# EAGLE design MAIN_BOARD_02 (EAGLE 9.5.2)

## Sheet 1 of 3
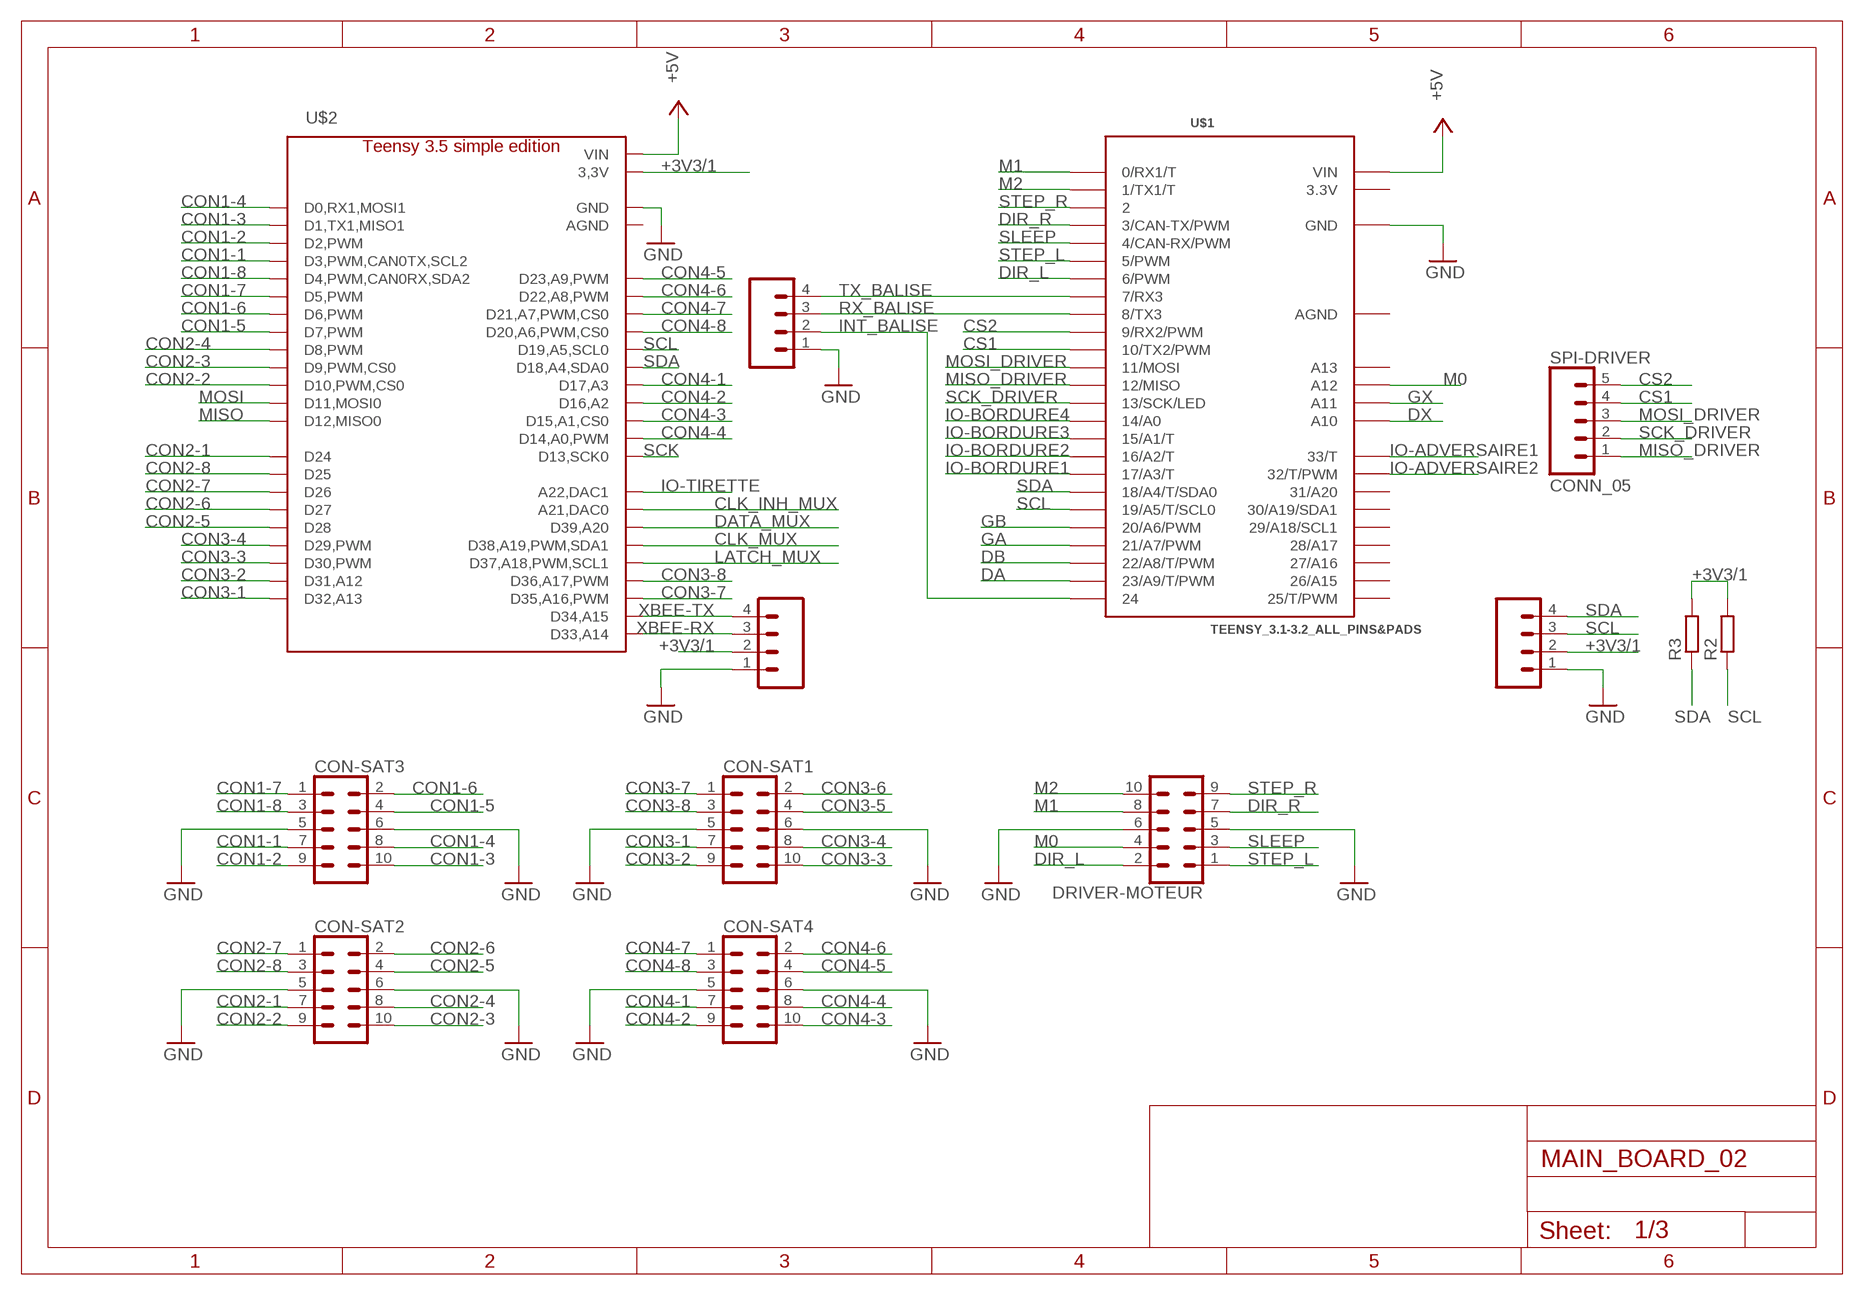
[diagram p0: schematic, sheet 1]

### Parts
COM-BALISE  CONN_04POLAR  [MOLEX-1X4]
COM-I2C  CONN_04POLAR  [MOLEX-1X4]
COM-XBEE  CONN_04POLAR  [MOLEX-1X4]
CON-SAT1  CONN_05X2SHD  [2X5-SHROUDED]
CON-SAT2  CONN_05X2SHD  [2X5-SHROUDED]
CON-SAT3  CONN_05X2SHD  [2X5-SHROUDED]
CON-SAT4  CONN_05X2SHD  [2X5-SHROUDED]
DRIVER-MOTEUR  CONN_05X2SHD  [2X5-SHROUDED]
R2  R-EU_R1206  [R1206]
R3  R-EU_R1206  [R1206]
SPI-DRIVER  CONN_05  [MOLEX-1X5]
U$1  TEENSY_3.1-3.2_ALL_PINS&PADS  [TEENSY_3.0-3.2_ALL_PINS_&_PADS]
U$2  TEENSY_3.5  [TEENSY_3.5_LIGHT]

### Nets
+3V3/1: COM-I2C.2 COM-XBEE.2 R2.2 R3.2 U$2.P$15(3,3V) U$2.P$46(3,3V)
+5V: U$1.VIN U$2.P$48(VIN) ; also sheet 2,3
CLK_INH_MUX: U$2.P$32(A21,DAC0) ; also sheet 2
CLK_MUX: U$2.P$30(D38,A19,PWM,SDA1) ; also sheet 2
CON1-1: CON-SAT3.7 U$2.P$5(D3,PWM,CAN0TX,SCL2)
CON1-2: CON-SAT3.9 U$2.P$4(D2,PWM)
CON1-3: CON-SAT3.10 U$2.P$3(D1,TX1,MISO1)
CON1-4: CON-SAT3.8 U$2.P$2(D0,RX1,MOSI1)
CON1-5: CON-SAT3.4 U$2.P$9(D7,PWM)
CON1-6: CON-SAT3.2 U$2.P$8(D6,PWM)
CON1-7: CON-SAT3.1 U$2.P$7(D5,PWM)
CON1-8: CON-SAT3.3 U$2.P$6(D4,PWM,CAN0RX,SDA2)
CON2-1: CON-SAT2.7 U$2.P$16(D24)
CON2-2: CON-SAT2.9 U$2.P$12(D10,PWM,CS0)
CON2-3: CON-SAT2.10 U$2.P$11(D9,PWM,CS0)
CON2-4: CON-SAT2.8 U$2.P$10(D8,PWM)
CON2-5: CON-SAT2.4 U$2.P$20(D28)
CON2-6: CON-SAT2.2 U$2.P$19(D27)
CON2-7: CON-SAT2.1 U$2.P$18(D26)
CON2-8: CON-SAT2.3 U$2.P$17(D25)
CON3-1: CON-SAT1.7 U$2.P$24(D32,A13)
CON3-2: CON-SAT1.9 U$2.P$23(D31,A12)
CON3-3: CON-SAT1.10 U$2.P$22(D30,PWM)
CON3-4: CON-SAT1.8 U$2.P$21(D29,PWM)
CON3-5: CON-SAT1.4
CON3-6: CON-SAT1.2
CON3-7: CON-SAT1.1 U$2.P$27(D35,A16,PWM)
CON3-8: CON-SAT1.3 U$2.P$28(D36,A17,PWM)
CON4-1: CON-SAT4.7 U$2.P$39(D17,A3)
CON4-2: CON-SAT4.9 U$2.P$38(D16,A2)
CON4-3: CON-SAT4.10 U$2.P$37(D15,A1,CS0)
CON4-4: CON-SAT4.8 U$2.P$36(D14,A0,PWM)
CON4-5: CON-SAT4.4 U$2.P$45(D23,A9,PWM)
CON4-6: CON-SAT4.2 U$2.P$44(D22,A8,PWM)
CON4-7: CON-SAT4.1 U$2.P$43(D21,A7,PWM,CS0)
CON4-8: CON-SAT4.3 U$2.P$42(D20,A6,PWM,CS0)
CS1: SPI-DRIVER.4 U$1.10(10/TX2/PWM)
CS2: SPI-DRIVER.5 U$1.9(9/RX2/PWM)
DA: U$1.23/A9(23/A9/T/PWM) ; also sheet 2
DATA_MUX: U$2.P$31(D39,A20) ; also sheet 2
DB: U$1.22/A8(22/A8/T/PWM) ; also sheet 2
DIR_L: DRIVER-MOTEUR.2 U$1.6(6/PWM)
DIR_R: DRIVER-MOTEUR.7 U$1.3(3/CAN-TX/PWM)
DX: U$1.A10 ; also sheet 2
GA: U$1.21/A7(21/A7/PWM) ; also sheet 2
GB: U$1.20/A6(20/A6/PWM) ; also sheet 2
GND: COM-BALISE.1 COM-I2C.1 COM-XBEE.1 CON-SAT1.5 CON-SAT1.6 CON-SAT2.5 CON-SAT2.6 CON-SAT3.5 CON-SAT3.6 CON-SAT4.5 CON-SAT4.6 DRIVER-MOTEUR.5 DRIVER-MOTEUR.6 U$1.GND U$1.GND2(GND) U$2.GND U$2.P$34(GND) ; also sheet 2,3
GX: U$1.A11 ; also sheet 2
INT_BALISE: COM-BALISE.2 U$1.24
IO-ADVERSAIRE1: U$1.33(33/T) ; also sheet 2
IO-ADVERSAIRE2: U$1.32(32/T/PWM) ; also sheet 2
IO-BORDURE1: U$1.17/A3(17/A3/T) ; also sheet 2
IO-BORDURE2: U$1.16/A2(16/A2/T) ; also sheet 2
IO-BORDURE3: U$1.15/A1(15/A1/T) ; also sheet 2
IO-BORDURE4: U$1.14/A0 ; also sheet 2
IO-TIRETTE: U$2.P$33(A22,DAC1) ; also sheet 2
LATCH_MUX: U$2.P$29(D37,A18,PWM,SCL1) ; also sheet 2
M0: DRIVER-MOTEUR.4 U$1.A12
M1: DRIVER-MOTEUR.8 U$1.0(0/RX1/T)
M2: DRIVER-MOTEUR.10 U$1.1(1/TX1/T)
MISO: U$2.P$14(D12,MISO0) ; also sheet 2
MISO_DRIVER: SPI-DRIVER.1 U$1.12(12/MISO)
MOSI: U$2.P$13(D11,MOSI0) ; also sheet 2
MOSI_DRIVER: SPI-DRIVER.3 U$1.11(11/MOSI)
RX_BALISE: COM-BALISE.3 U$1.8(8/TX3)
SCK: U$2.P$35(D13,SCK0) ; also sheet 2
SCK_DRIVER: SPI-DRIVER.2 U$1.13(13/SCK/LED)
SCL: COM-I2C.3 R2.1 U$1.19/A5(19/A5/T/SCL0) U$2.P$41(D19,A5,SCL0)
SDA: COM-I2C.4 R3.1 U$1.18/A4(18/A4/T/SDA0) U$2.P$40(D18,A4,SDA0)
SLEEP: DRIVER-MOTEUR.3 U$1.4(4/CAN-RX/PWM)
STEP_L: DRIVER-MOTEUR.1 U$1.5(5/PWM)
STEP_R: DRIVER-MOTEUR.9 U$1.2
TX_BALISE: COM-BALISE.4 U$1.7(7/RX3)
XBEE-RX: COM-XBEE.3 U$2.P$25(D33,A14)
XBEE-TX: COM-XBEE.4 U$2.P$26(D34,A15)
Unconnected: U$1.25(25/T/PWM) U$1.26(26/A15) U$1.27(27/A16) U$1.28(28/A17) U$1.29(29/A18/SCL1) U$1.30(30/A19/SDA1) U$1.31(31/A20) U$1.A13 U$2.P$47(AGND)

## Sheet 2 of 3
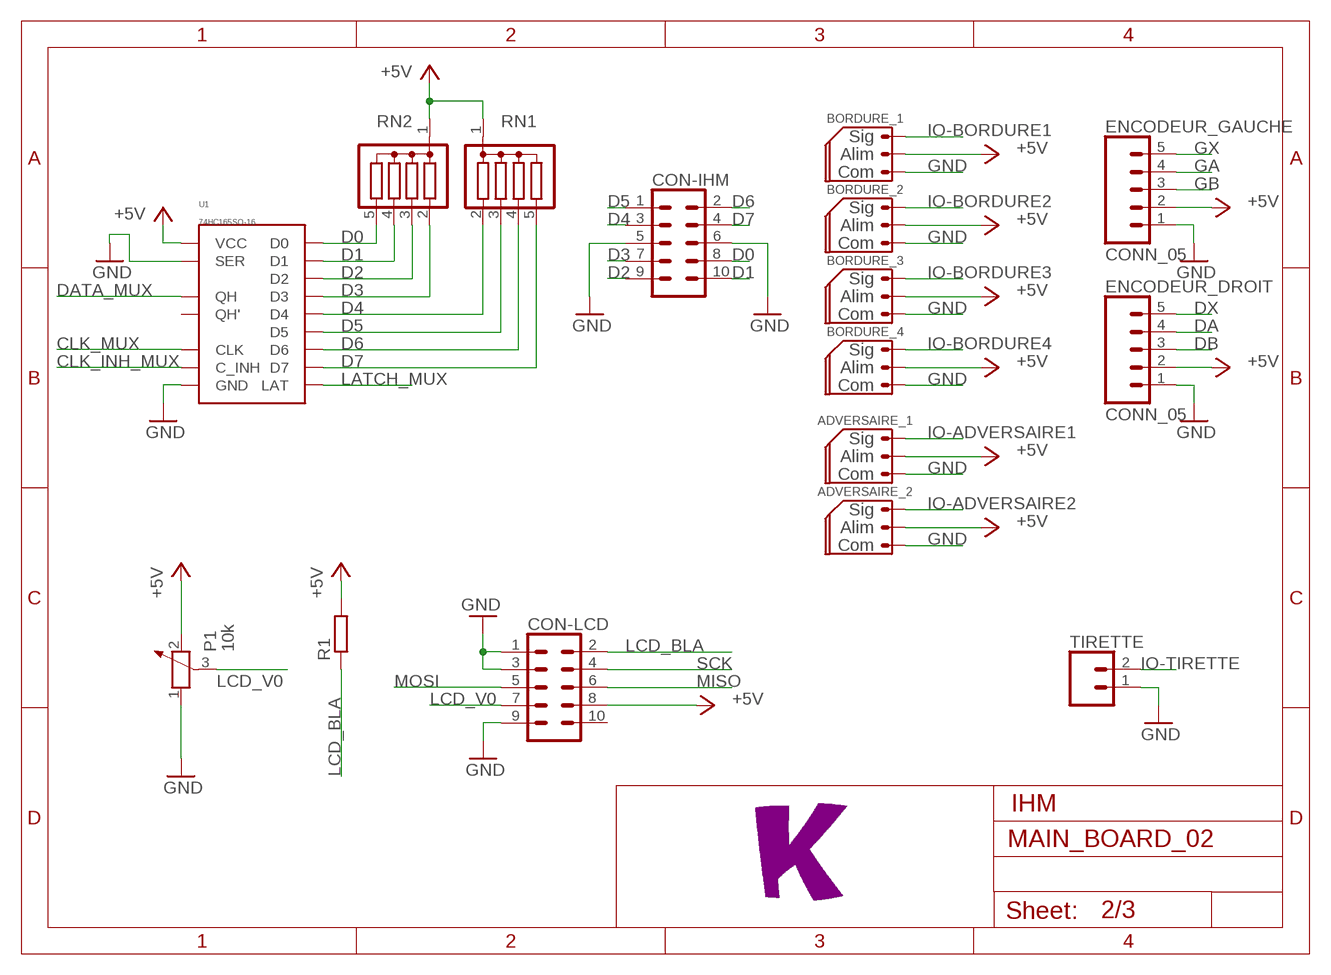
[diagram p1: schematic, sheet 2]

### Parts
ADVERSAIRE_1  CONN_03_SERVO  [MOLEX-1X3]
ADVERSAIRE_2  CONN_03_SERVO  [MOLEX-1X3]
BORDURE_1  CONN_03_SERVO  [MOLEX-1X3]
BORDURE_2  CONN_03_SERVO  [MOLEX-1X3]
BORDURE_3  CONN_03_SERVO  [MOLEX-1X3]
BORDURE_4  CONN_03_SERVO  [MOLEX-1X3]
CON-IHM  CONN_05X2SHD  [2X5-SHROUDED]
CON-LCD  CONN_05X2SHD  [2X5-SHROUDED]
ENCODEUR_DROIT  CONN_05  [MOLEX-1X5]
ENCODEUR_GAUCHE  CONN_05  [MOLEX-1X5]
P1  10k  POTENTIOMETER_PT-10  [PT-10]
R1  R-EU_R1206  [R1206]
RN1  G04R  [SIL5]
RN2  G04R  [SIL5]
TIRETTE  CONN_02POLAR  [MOLEX-1X2]
U1  74HC165SO-16  [SO-16]
U$3  LOGO_K  [LOGO_KARIBOU]

### Nets
+5V: ADVERSAIRE_1.2 ADVERSAIRE_2.2 BORDURE_1.2 BORDURE_2.2 BORDURE_3.2 BORDURE_4.2 CON-LCD.8 ENCODEUR_DROIT.2 ENCODEUR_GAUCHE.2 P1.2 R1.2 RN1.1 RN2.1 U1.16(VCC) ; also sheet 1,3
CLK_INH_MUX: U1.15(C_INH) ; also sheet 1
CLK_MUX: U1.2(CLK) ; also sheet 1
D0: CON-IHM.8 RN2.5 U1.11(D0)
D1: CON-IHM.10 RN2.4 U1.12(D1)
D2: CON-IHM.9 RN2.3 U1.13(D2)
D3: CON-IHM.7 RN2.2 U1.14(D3)
D4: CON-IHM.3 RN1.2 U1.3(D4)
D5: CON-IHM.1 RN1.3 U1.4(D5)
D6: CON-IHM.2 RN1.4 U1.5(D6)
D7: CON-IHM.4 RN1.5 U1.6(D7)
DA: ENCODEUR_DROIT.4 ; also sheet 1
DATA_MUX: U1.9(QH) ; also sheet 1
DB: ENCODEUR_DROIT.3 ; also sheet 1
DX: ENCODEUR_DROIT.5 ; also sheet 1
GA: ENCODEUR_GAUCHE.4 ; also sheet 1
GB: ENCODEUR_GAUCHE.3 ; also sheet 1
GND: ADVERSAIRE_1.1 ADVERSAIRE_2.1 BORDURE_1.1 BORDURE_2.1 BORDURE_3.1 BORDURE_4.1 CON-IHM.5 CON-IHM.6 CON-LCD.1 CON-LCD.3 CON-LCD.9 ENCODEUR_DROIT.1 ENCODEUR_GAUCHE.1 P1.1 TIRETTE.1 U1.8(GND) U1.10(SER) ; also sheet 1,3
GX: ENCODEUR_GAUCHE.5 ; also sheet 1
IO-ADVERSAIRE1: ADVERSAIRE_1.3 ; also sheet 1
IO-ADVERSAIRE2: ADVERSAIRE_2.3 ; also sheet 1
IO-BORDURE1: BORDURE_1.3 ; also sheet 1
IO-BORDURE2: BORDURE_2.3 ; also sheet 1
IO-BORDURE3: BORDURE_3.3 ; also sheet 1
IO-BORDURE4: BORDURE_4.3 ; also sheet 1
IO-TIRETTE: TIRETTE.2 ; also sheet 1
LATCH_MUX: U1.1(LAT) ; also sheet 1
LCD_BLA: CON-LCD.2 R1.1
LCD_V0: CON-LCD.7 P1.3
MISO: CON-LCD.6 ; also sheet 1
MOSI: CON-LCD.5 ; also sheet 1
SCK: CON-LCD.4 ; also sheet 1
Unconnected: CON-LCD.10 U1.7(QH')

### Notes on the sheet
- IHM

## Sheet 3 of 3
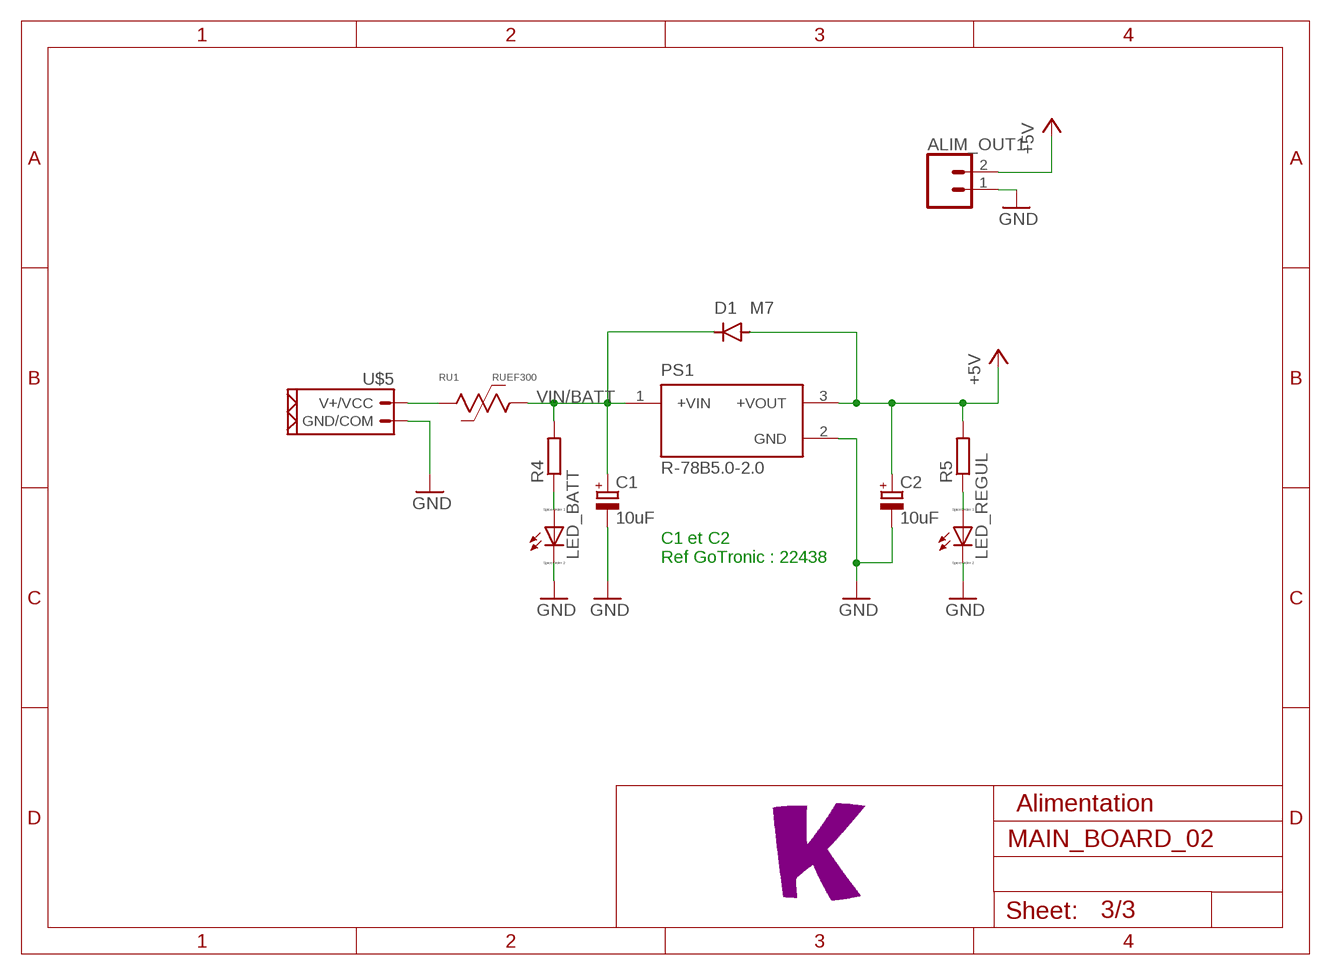
[diagram p2: schematic, sheet 3]

### Parts
ALIM_OUT1  CONN_02POLAR  [MOLEX-1X2]
C1  10uF  CPOL-EU153CLV-0505  [153CLV-0505]
C2  10uF  CPOL-EU153CLV-0505  [153CLV-0505]
D1  M7  CDBM1100-G  [MINI-SMA]
LED_BATT  LED_E  [LED_1206]
LED_REGUL  LED_E  [LED_1206]
PS1  R-78B5.0-2.0  [CONV_R-78B5.0-2.0]
R4  R-EU_R1206  [R1206]
R5  R-EU_R1206  [R1206]
RU1  RUEF300  [RUEF300]
U$4  LOGO_K  [LOGO_KARIBOU]
U$5  CONN_02_PUIXT30  [XT30_FEMALE]

### Nets
+5V: ALIM_OUT1.2 C2.+ D1.ANODE PS1.3(+VOUT) R5.2 ; also sheet 1,2
GND: ALIM_OUT1.1 C1.- C2.- LED_BATT.C LED_REGUL.C PS1.2(GND) U$5.P$2(GND/COM) ; also sheet 1,2
N$1: LED_REGUL.A R5.1
N$3: LED_BATT.A R4.1
N$4: RU1.P$1 U$5.P$1(V+/VCC)
VIN/BATT: C1.+ D1.KATHODE PS1.1(+VIN) R4.2 RU1.P$2

### Notes on the sheet
- C1 et C2
  Ref GoTronic : 22438
- Alimentation

## Power pins joined to a net without a drawn wire
3.3V: U$1.3.3V U$1.3.3V2(3.3V)
AGND: U$1.AGND

## Library data of the parts
ADVERSAIRE_1 ADVERSAIRE_2 BORDURE_1-BORDURE_4 = OPENBOT:CONN_03_SERVO
ALIM_OUT1 TIRETTE = OPENBOT:CONN_02: Multi connection point. Often used as Generic Header-pin footprint for 0.1 inch spaced/style header connections On any of the 0.1 inch spaced packages, you can populate with these: Break Away Headers - Straight <https://www.sparkfun.com/products/116> (PRT-00116) Break Away Male Headers - Right Angle <https://www.sparkfun.com/products/553> (PRT-00553) Female Headers <https://www.sparkfun.com/products/115> (PRT-00115) Break Away Headers - Machine Pin <https://www.sparkfun.com/products/117> (PRT-00117) Break Away Female Headers - Swiss Machine Pin <https://www.sparkfun.com/products/743> (PRT-00743) For SCREWTERMINALS and SPRING TERMINALS visit here: Screw Terimnals on SparkFun.com <https://www.sparkfun.com/search/results?term=Screw+Terminals> (5mm/3.5mm/2.54mm spacing) This device is also useful as a general connection point to wire up your design to another part of your project. Our various solder wires solder well into these plated through hole pads. Hook-Up Wire - Assortment (Stranded, 22 AWG) <https://www.sparkfun.com/products/11375> (PRT-11375) Hook-Up Wire - Assortment (Solid Core, 22 AWG) <https://www.sparkfun.com/products/11367> (PRT-11367) View the entire wire category on our website here <https://www.sparkfun.com/categories/141> Special notes: Molex polarized connector foot print use with: PRT-08233 with associated crimp pins and housings. 2.54_SCREWTERM for use with PRT-10571. 3.5mm Screw Terminal footprints for PRT-08084 5mm Screw Terminal footprints for use with PRT-08432 Multi connection point. Often used as Generic Header-pin footprint for 0.1 inch spaced/style header connections On any of the 0.1 inch spaced packages, you can populate with these: Break Away Headers - Straight <https://www.sparkfun.com/products/116> (PRT-00116) Break Away Male Headers - Right Angle <https://www.sparkfun.com/products/553> (PRT-00553) Female Headers <https://www.sparkfun.com/products/115> (PRT-00115) Break Away Headers - Machine Pin <https://www.sparkfun.com/products/117> (PRT-00117) Break Away Female Headers - Swiss Machine Pin <https://www.sparkfun.com/products/743> (PRT-00743) For SCREWTERMINALS and SPRING TERMINALS visit here: Screw Terimnals on SparkFun.com <https://www.sparkfun.com/search/results?term=Screw+Terminals> (5mm/3.5mm/2.54mm spacing) This device is also useful as a general connection point to wire up your design to another part of your project. Our various solder wires solder well into these plated through hole pads. Hook-Up Wire - Assortment (Stranded, 22 AWG) <https://www.sparkfun.com/products/11375> (PRT-11375) Hook-Up Wire - Assortment (Solid Core, 22 AWG) <https://www.sparkfun.com/products/11367> (PRT-11367) View the entire wire category on our website here <https://www.sparkfun.com/categories/141> Special notes: Molex polarized connector foot print use with: PRT-08233 with associated crimp pins and housings. 2.54_SCREWTERM for use with PRT-10571. 3.5mm Screw Terminal footprints for PRT-08084 5mm Screw Terminal footprints for use with PRT-08432; SF_ID: PRT-09918
C1 C2 = rcl:CPOL-EU: POLARIZED CAPACITOR, European symbol; SPICEPREFIX: C
COM-BALISE COM-I2C COM-XBEE = OPENBOT:CONN_04: Multi connection point. Often used as Generic Header-pin footprint for 0.1 inch spaced/style header connections On any of the 0.1 inch spaced packages, you can populate with these: Break Away Headers - Straight <https://www.sparkfun.com/products/116> (PRT-00116) Break Away Male Headers - Right Angle <https://www.sparkfun.com/products/553> (PRT-00553) Female Headers <https://www.sparkfun.com/products/115> (PRT-00115) Break Away Headers - Machine Pin <https://www.sparkfun.com/products/117> (PRT-00117) Break Away Female Headers - Swiss Machine Pin <https://www.sparkfun.com/products/743> (PRT-00743) For SCREWTERMINALS and SPRING TERMINALS visit here: Screw Terimnals on SparkFun.com <https://www.sparkfun.com/search/results?term=Screw+Terminals> (5mm/3.5mm/2.54mm spacing) This device is also useful as a general connection point to wire up your design to another part of your project. Our various solder wires solder well into these plated through hole pads. Hook-Up Wire - Assortment (Stranded, 22 AWG) <https://www.sparkfun.com/products/11375> (PRT-11375) Hook-Up Wire - Assortment (Solid Core, 22 AWG) <https://www.sparkfun.com/products/11367> (PRT-11367) View the entire wire category on our website here <https://www.sparkfun.com/categories/141> Special notes: Molex polarized connector foot print use with SKU : PRT-08231 with associated crimp pins and housings. 1MM SMD Version SKU: PRT-10208 Multi connection point. Often used as Generic Header-pin footprint for 0.1 inch spaced/style header connections On any of the 0.1 inch spaced packages, you can populate with these: Break Away Headers - Straight <https://www.sparkfun.com/products/116> (PRT-00116) Break Away Male Headers - Right Angle <https://www.sparkfun.com/products/553> (PRT-00553) Female Headers <https://www.sparkfun.com/products/115> (PRT-00115) Break Away Headers - Machine Pin <https://www.sparkfun.com/products/117> (PRT-00117) Break Away Female Headers - Swiss Machine Pin <https://www.sparkfun.com/products/743> (PRT-00743) For SCREWTERMINALS and SPRING TERMINALS visit here: Screw Terimnals on SparkFun.com <https://www.sparkfun.com/search/results?term=Screw+Terminals> (5mm/3.5mm/2.54mm spacing) This device is also useful as a general connection point to wire up your design to another part of your project. Our various solder wires solder well into these plated through hole pads. Hook-Up Wire - Assortment (Stranded, 22 AWG) <https://www.sparkfun.com/products/11375> (PRT-11375) Hook-Up Wire - Assortment (Solid Core, 22 AWG) <https://www.sparkfun.com/products/11367> (PRT-11367) View the entire wire category on our website here <https://www.sparkfun.com/categories/141> Special notes: Molex polarized connector foot print use with SKU : PRT-08231 with associated crimp pins and housings. 1MM SMD Version SKU: PRT-10208; PROD_ID: CONN-08186; SF_ID: PRT-08231
CON-IHM CON-LCD CON-SAT1-CON-SAT4 DRIVER-MOTEUR = OPENBOT:CONN_05X2: Multi connection point. Often used as Generic Header-pin footprint for 0.1 inch spaced/style header connections For AVR SPI programming port, see special device with nice symbol: "AVR_SPI_PROG_5x2.dev" You can populate with any combo of single row headers, but if you'd like an exact match, check these: 2x5 AVR ICSP Male Header <https://www.sparkfun.com/products/778> (PRT-00778) 2x5 Pin Shrouded Header <https://www.sparkfun.com/products/8506> (PRT-08506) On any of the 0.1 inch spaced packages, you can populate with these: Break Away Headers - Straight <https://www.sparkfun.com/products/116> (PRT-00116) Break Away Male Headers - Right Angle <https://www.sparkfun.com/products/553> (PRT-00553) Female Headers <https://www.sparkfun.com/products/115> (PRT-00115) Break Away Headers - Machine Pin <https://www.sparkfun.com/products/117> (PRT-00117) Break Away Female Headers - Swiss Machine Pin <https://www.sparkfun.com/products/743> (PRT-00743) Special note: the shrouded connector mates well with our 5x2 ribbon cables: 2x5 Pin IDC Ribbon Cable <https://www.sparkfun.com/products/8535> (PRT-08535); PROD_ID: CONN-08671; SF_ID: PRT-08506
D1 = fab:CDBM1100-G: Diode schottky 100V 1A mini-SMA as found in the fablab inventory Reverse Voltage: 100 Volts Forward Current: 1.0 Amp Maximum forward voltage: 0.85 Volts Made by Zaerc.
ENCODEUR_DROIT ENCODEUR_GAUCHE SPI-DRIVER = OPENBOT:CONN_05
LED_BATT LED_REGUL = eagle-ltspice:LED_E: LED Source: http://www.osram.convergy.de Source: www.luxeon.com Source: www.kingbright.com; SPICEMODEL: NONE; SPICEPREFIX: D; SPICETYPE: diode
P1 = rcl:POTENTIOMETER_: Potentiometer
PS1 = OPENBOT:R-78B5.0-2.0: 2.0 Amp SIP3 Single Output; AVAILABILITY: Unavailable; DESCRIPTION: 2A DC/DC-Converter 'INNOLINE' SIP3 reg; MF: Recom Power; MP: R-78B5.0-2.0; PACKAGE: SIP-3 Recom Power; PRICE: None
R1-R5 = rcl:R-EU_: RESISTOR, European symbol; SPICEPREFIX: R
RN1 RN2 = resistor-sil:G04R: SIL RESISTOR; OC_FARNELL: unknown; OC_NEWARK: unknown
RU1 = OPENBOT:RUEF300
U1 = OPENBOT:74HC165; AVAILABILITY: Unavailable; DESCRIPTION: Shift Shift Register 1 Element 8 Bit 16-SO; MF: Nexperia USA; MP: 74HC165; PACKAGE: VFQFN-16 STMicroelectronics; PRICE: None
U$1 = OPENBOT:TEENSY_3.1-3.2_ALL_PINS&PADS: Footprint for Teensy 3.1 or 3.2 board using all pads and all through-holes. Pads need a 2x7 0.1" SMD header.
U$2 = KARIBOUS:TEENSY_3.5
U$3 U$4 = KARIBOUS:LOGO_K
U$5 = OPENBOT:CONN_02_PUI

## Board
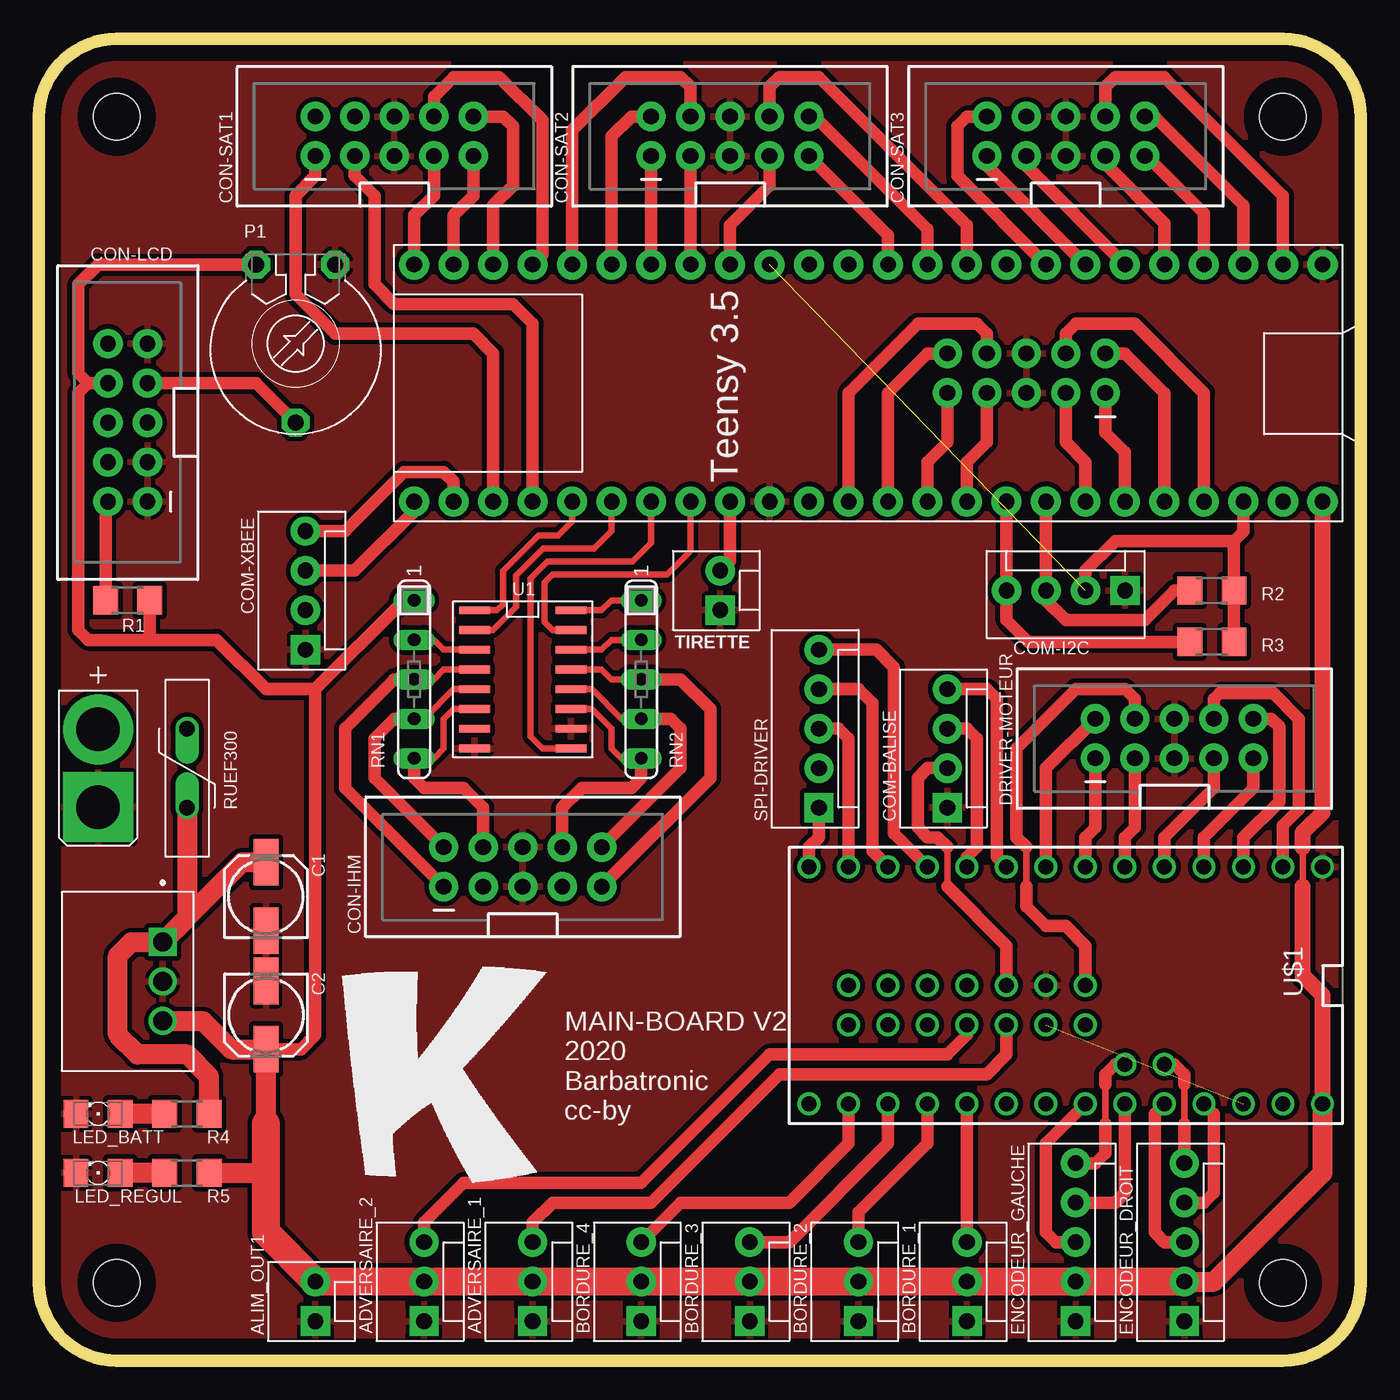
[diagram p3: board, top side]
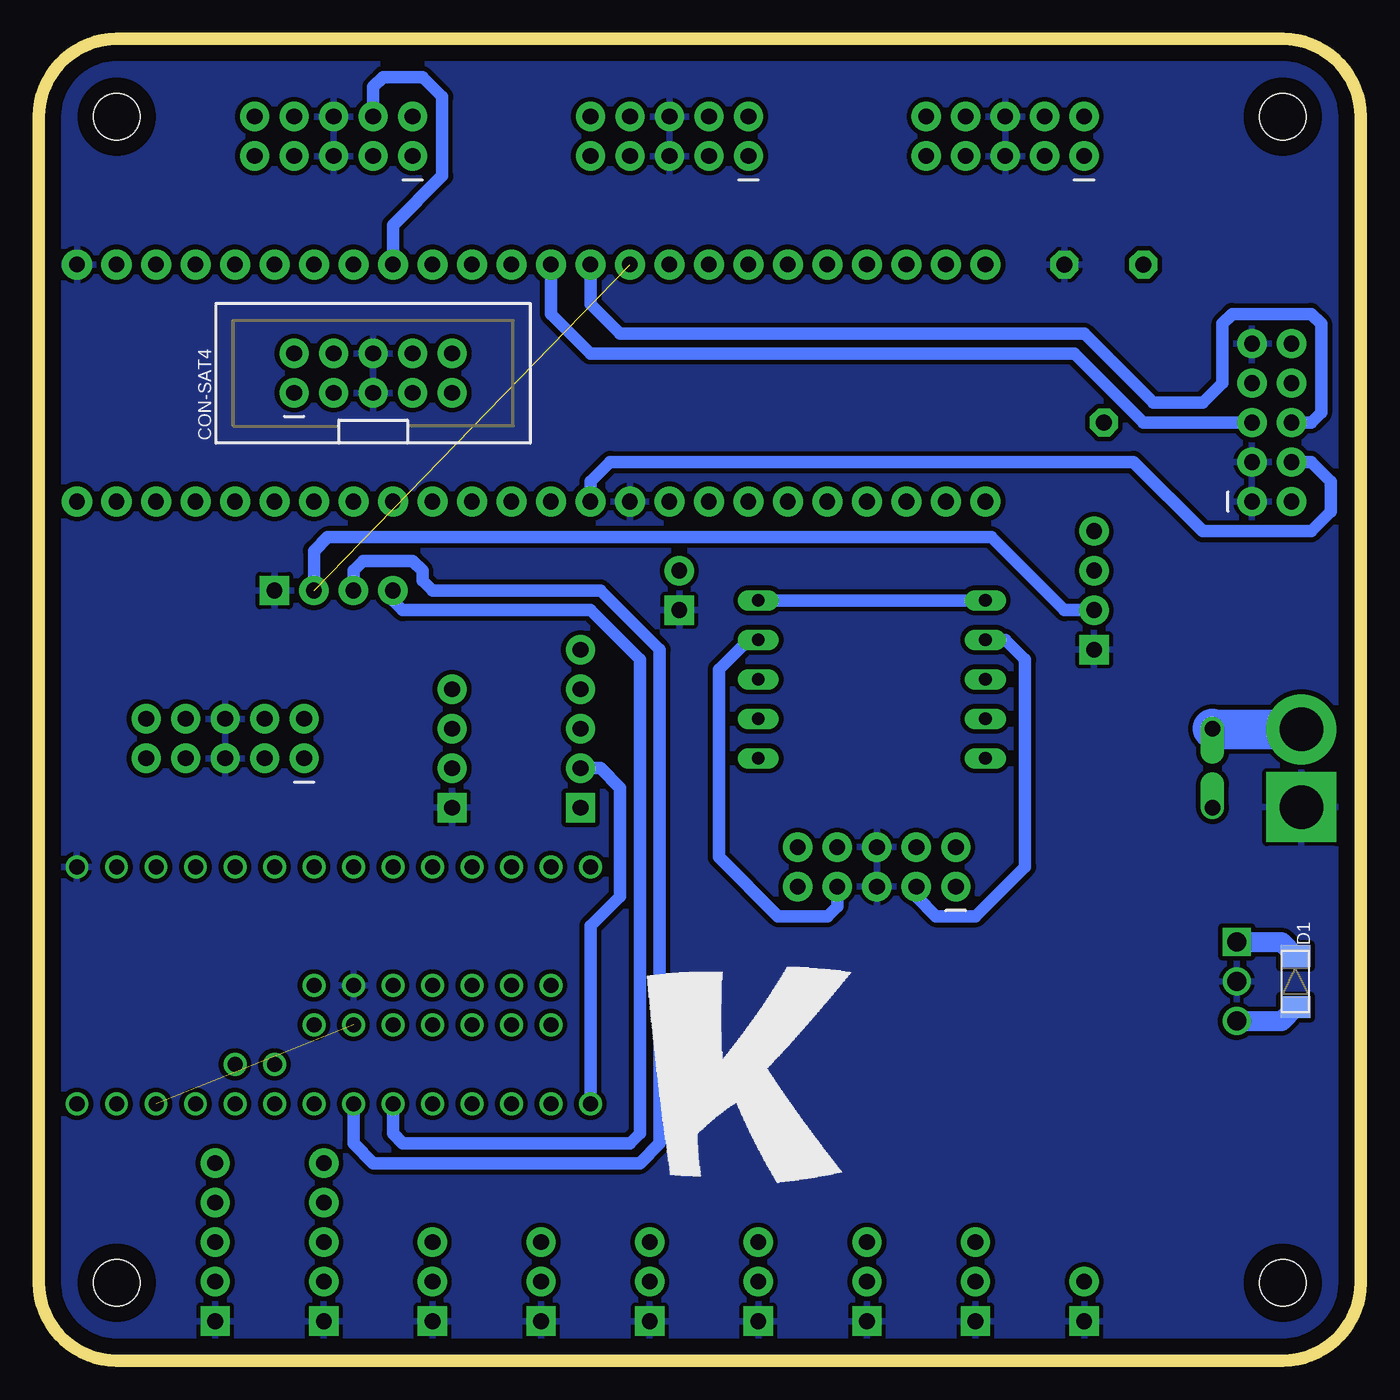
[diagram p4: board, bottom side, seen from below]

Size 85 x 85 mm. Coordinates in mm from the lower left corner, seen from the top.
Outline: 5,0 80,0 arc90 85,5 85,80 arc90 80,85 5,85 arc90 0,80 0,5 arc90 5,0
Copper layers (1*16): Top 0.035mm / dielectric 1.5mm / Bottom 0.035mm
Design rules "default *": minimum track width 6mil, minimum drill 0.35mm, track to track 12mil, track to pad 12mil, pad to pad 6mil, via to via 6mil, smd to smd 6mil, copper to edge 40mil, drill to drill 6mil, minimum pad ring 10mil, minimum via ring 8mil, stop-mask expansion 4mil, vias tented up to drill 0mil, thermal gap 10mil
Holes 3 mm at 5,5 5,80 80,5 80,80

### Footprints (pad centres in the part's own frame; a part is rotated, then mirrored left to right if it is on the bottom)
MOLEX-1X3 = drill 1.016 pad 1.88 square: 1 0,0 | drill 1.016 pad 1.88: 2 2.54,0; 3 5.08,0
MOLEX-1X2 = drill 1.016 pad 1.88 square: 1 0,0 | drill 1.016 pad 1.88: 2 2.54,0
153CLV-0505 = smd 3 x 1.6: + 2.2,0; - -2.2,0
MOLEX-1X4 = drill 1.016 pad 1.88 square: 1 0,0 | drill 1.016 pad 1.88: 2 2.54,0; 3 5.08,0; 4 7.62,0
2X5-SHROUDED = drill 1.016 pad 1.88: 1 -1.27,5.08; 2 1.27,5.08; 3 -1.27,2.54; 4 1.27,2.54; 5 -1.27,0; 6 1.27,0; 7 -1.27,-2.54; 8 1.27,-2.54; 9 -1.27,-5.08; 10 1.27,-5.08
MINI-SMA = smd 1.4 x 1.9: ANODE 1.65,0; KATHODE -1.65,0
MOLEX-1X5 = drill 1.016 pad 1.88 square: 1 0,0 | drill 1.016 pad 1.88: 2 2.54,0; 3 5.08,0; 4 7.62,0; 5 10.16,0
LED_1206 = smd 1.6 x 1.803: A -1.422,0; C 1.422,0
PT-10 = drill 1.016 pad 1.778 octagon: 1 -2.54,-5.08; 2 2.54,-5.08; 3 0,5.08
CONV_R-78B5.0-2.0 = drill 1.2 square: 1 -2.54,2.25 | drill 1.2: 2 0,2.25; 3 2.54,2.25
R1206 = smd 1.6 x 1.803: 1 -1.422,0; 2 1.422,0
SIL5 = drill 0.813 long: 1 -5.08,0; 2 -2.54,0; 3 0,0; 4 2.54,0; 5 5.08,0
RUEF300 = drill 1 offset: P$1 -2.54,0; P$2 2.54,0
SO-16 = smd 0.5 x 2: 1 -4.445,-3.1; 2 -3.175,-3.1; 3 -1.905,-3.1; 4 -0.635,-3.1; 5 0.635,-3.1; 6 1.905,-3.1; 7 3.175,-3.1; 8 4.445,-3.1; 9 4.445,3.1; 10 3.175,3.1; 11 1.905,3.1; 12 0.635,3.1; 13 -0.635,3.1; 14 -1.905,3.1; 15 -3.175,3.1; 16 -4.445,3.1
TEENSY_3.0-3.2_ALL_PINS_&_PADS = drill 0.965: 0 -7.62,13.97; 1 -7.62,11.43; 2 -7.62,8.89; 3 -7.62,6.35; 3.3V 7.62,11.43; 3.3V2 2.54,-1.27; 4 -7.62,3.81; 5 -7.62,1.27; 6 -7.62,-1.27; 7 -7.62,-3.81; 8 -7.62,-6.35; 9 -7.62,-8.89; 10 -7.62,-11.43; 11 -7.62,-13.97; 12 -7.62,-16.51; 13 7.62,-16.51; 14/A0 7.62,-13.97; 15/A1 7.62,-11.43; 16/A2 7.62,-8.89; 17/A3 7.62,-6.35; 18/A4 7.62,-3.81; 19/A5 7.62,-1.27; 20/A6 7.62,1.27; 21/A7 7.62,3.81; 22/A8 7.62,6.35; 23/A9 7.62,8.89; 24 0,-3.81; 25 0,-6.35; 26 0,-8.89; 27 0,-11.43; 28 0,-13.97; 29 2.54,-13.97; 30 2.54,-11.43; 31 2.54,-8.89; 32 2.54,-6.35; 33 2.54,-3.81; A10 5.08,6.35; A11 5.08,3.81; A12 0,1.27; A13 2.54,1.27; AGND 7.62,13.97; GND -7.62,16.51; GND2 0,-1.27; VIN 7.62,16.51
TEENSY_3.5_LIGHT = drill 1 pad 1.93: GND -7.62,0; P$2 -7.62,-2.54; P$3 -7.62,-5.08; P$4 -7.62,-7.62; P$5 -7.62,-10.16; P$6 -7.62,-12.7; P$7 -7.62,-15.24; P$8 -7.62,-17.78; P$9 -7.62,-20.32; P$10 -7.62,-22.86; P$11 -7.62,-25.4; P$12 -7.62,-27.94; P$13 -7.62,-30.48; P$14 -7.62,-33.02; P$15 -7.62,-35.56; P$16 -7.62,-38.1; P$17 -7.62,-40.64; P$18 -7.62,-43.18; P$19 -7.62,-45.72; P$20 -7.62,-48.26; P$21 -7.62,-50.8; P$22 -7.62,-53.34; P$23 -7.62,-55.88; P$24 -7.62,-58.42; P$25 7.62,-58.42; P$26 7.62,-55.88; P$27 7.62,-53.34; P$28 7.62,-50.8; P$29 7.62,-48.26; P$30 7.62,-45.72; P$31 7.62,-43.18; P$32 7.62,-40.64; P$33 7.62,-38.1; P$34 7.62,-35.56; P$35 7.62,-33.02; P$36 7.62,-30.48; P$37 7.62,-27.94; P$38 7.62,-25.4; P$39 7.62,-22.86; P$40 7.62,-20.32; P$41 7.62,-17.78; P$42 7.62,-15.24; P$43 7.62,-12.7; P$44 7.62,-10.16; P$45 7.62,-7.62; P$46 7.62,-5.08; P$47 7.62,-2.54; P$48 7.62,0
XT30_FEMALE = drill 2.8 pad 4.5: P$1 -2.5,0 | drill 2.8 pad 4.5 square: P$2 2.5,0

### Placement (x,y rotation side)
ADVERSAIRE_1  31.75,2.54 90 top
ADVERSAIRE_2  24.77,2.54 90 top
ALIM_OUT1  17.78,2.54 90 top
BORDURE_1  59.69,2.54 90 top
BORDURE_2  52.7,2.54 90 top
BORDURE_3  45.72,2.54 90 top
BORDURE_4  38.73,2.54 90 top
C1  14.61,29.84 90 top
C2  14.61,22.23 270 top
COM-BALISE  58.42,35.56 90 top
COM-I2C  69.85,49.53 180 top
COM-XBEE  17.14,45.72 90 top
CON-IHM  31.11,31.75 90 top
CON-LCD  5.71,60.33 180 top
CON-SAT1  22.86,78.74 90 top
CON-SAT2  44.45,78.74 90 top
CON-SAT3  66.04,78.74 90 top
CON-SAT4  63.5,63.5 90 bottom
D1  4.19,24.38 270 bottom
DRIVER-MOTEUR  73.03,40.01 90 top
ENCODEUR_DROIT  73.66,2.54 90 top
ENCODEUR_GAUCHE  66.67,2.54 90 top
LED_BATT  3.81,15.88 180 top
LED_REGUL  3.81,12.06 180 top
P1  16.51,65.41 180 top
PS1  5.71,24.38 270 top
R1  5.71,48.9 0 top
R2  75.44,49.53 0 top
R3  75.44,46.23 0 top
R4  9.53,15.88 0 top
R5  9.53,12.06 0 top
RN1  24.13,43.81 270 top
RN2  38.73,43.81 270 top
RU1  9.53,38.1 270 top
SPI-DRIVER  50.16,35.56 90 top
TIRETTE  43.81,48.26 90 top
U1  31.11,43.81 270 top
U$1  66.04,24.13 270 top
U$2  82.55,62.87 270 top
U$3  19.68,11.43 0 top
U$4  45.72,11.43 0 bottom
U$5  3.81,38.1 270 top

### Tracks (layer width: path | path; a pad name or v marks a point on that pad's centre or on a via)
3.3V  (1 unrouted)
+3V3/1  (1 unrouted)
  Top 0.813: COM-I2C.2 67.31,50.8 69.22,52.7 76.86,52.7 | R3.2 R2.2 76.86,52.7 | 76.86,52.7 77.47,53.31 U$2.P$46
  Bottom 0.813: COM-XBEE.2 19.05,48.26 23.75,52.96 66.42,52.96 67.31,52.07 COM-I2C.2
+5V
  Top 0.406: U1.16 36.2,48.26 36.83,48.9 RN2.1 | 81.28,30.48 81.28,33.02
  Top 0.813: 3.17,62.87 2.54,63.5 2.54,69.22 3.81,70.48 P1.2 | CON-LCD.8 3.17,62.87 | 3.17,62.87 2.54,62.23 2.54,46.99 3.17,46.35 6.99,46.35 | 6.99,46.35 7.14,46.51 R1.2 | 17.78,43.18 23.5,48.9 RN1.1 | 6.99,46.35 11.43,46.35 14.61,43.18 17.78,43.18 | C2.+ 16.85,20.02 17.78,20.95 17.78,43.18
  Top 1.016: 81.28,30.48 81.28,24.77 82.55,23.5 U$1.VIN | 81.28,33.02 81.28,33.96 82.55,35.23 U$2.P$48
  Top 1.27: R5.2 14.61,12.06 | PS1.3 10.54,21.84 12.36,20.02 C2.+ 14.61,15.24 | ENCODEUR_DROIT.2 75.56,5.08 82.55,12.06 U$1.VIN
  Top 1.8: ENCODEUR_DROIT.2 ENCODEUR_GAUCHE.2 BORDURE_1.2 BORDURE_2.2 BORDURE_3.2 BORDURE_4.2 ADVERSAIRE_1.2 ADVERSAIRE_2.2 ALIM_OUT1.2 14.61,8.26 14.61,12.06 14.61,15.24
  Bottom 0.813: RN1.1 RN2.1
  Bottom 1.27: PS1.3 5.08,21.84 D1.ANODE
CLK_INH_MUX
  Top 0.406: U1.15 33.02,46.99 32.51,47.5 32.51,50.04 33.02,50.55 40.39,50.55 41.91,52.07 U$2.P$32
CLK_MUX
  Top 0.406: U$2.P$30 36.83,53.34 35.71,52.22 32.43,52.22 30.68,50.48 30.68,48.46 29.21,46.99 U1.2
CON1-1
  Top 0.813: CON-SAT3.7 68.58,76.96 72.39,73.15 U$2.P$5
CON1-2
  Top 0.813: CON-SAT3.9 71.25,77.47 74.93,73.79 U$2.P$4
CON1-3
  Top 0.813: CON-SAT3.10 71.75,80.01 77.47,74.3 U$2.P$3
CON1-4
  Top 0.813: U$2.P$2 80.01,74.93 72.39,82.55 69.22,82.55 68.58,81.92 CON-SAT3.8
CON1-5
  Bottom 0.813: U$2.P$9 62.23,73.03 59.05,76.2 59.05,81.28 60.33,82.55 62.87,82.55 63.5,81.92 CON-SAT3.4
CON1-6
  Top 0.813: U$2.P$8 59.05,76.2 59.05,79.38 59.69,80.01 CON-SAT3.2
CON1-7
  Top 0.813: U$2.P$7 60.96,76.83 CON-SAT3.1
CON1-8
  Top 0.813: U$2.P$6 63.5,76.83 CON-SAT3.3
CON2-1
  Top 0.813: CON-SAT2.7 46.99,75.56 44.45,73.03 U$2.P$16
CON2-2
  Top 0.813: CON-SAT2.9 54.61,72.39 U$2.P$12
CON2-3
  Top 0.813: CON-SAT2.10 49.91,80.01 57.15,72.77 U$2.P$11
CON2-4
  Top 0.813: U$2.P$10 59.69,73.03 50.16,82.55 47.62,82.55 46.99,81.92 CON-SAT2.8
CON2-5
  Top 0.813: U$2.P$20 34.29,79.12 37.72,82.55 41.27,82.55 41.91,81.92 CON-SAT2.4
CON2-6
  Top 0.813: U$2.P$19 36.83,78.74 38.1,80.01 CON-SAT2.2
CON2-7
  Top 0.813: CON-SAT2.1 U$2.P$18
CON2-8
  Top 0.813: U$2.P$17 CON-SAT2.3
CON3-1
  Top 0.813: U$2.P$24 24.13,73.66 25.4,74.93 CON-SAT1.7
CON3-2
  Top 0.813: U$2.P$23 26.67,73.66 27.94,74.93 CON-SAT1.9
CON3-3
  Top 0.813: U$2.P$22 29.21,74.3 30.48,75.56 30.48,79.38 29.84,80.01 CON-SAT1.10
CON3-4
  Top 0.813: CON-SAT1.8 25.4,81.28 26.67,82.55 29.59,82.55 32.38,79.76 32.38,71.12 U$2.P$21
CON3-7
  Top 0.813: CON-SAT1.1 17.78,76.2 16.51,74.93 16.51,68.58 19.05,66.04 27.94,66.04 29.21,64.77 U$2.P$27
CON3-8
  Top 0.813: U$2.P$28 31.75,66.67 30.48,67.94 22.86,67.94 21.59,69.22 21.59,74.93 20.32,76.2 CON-SAT1.3
CON4-1
  Top 0.813: CON-SAT4.7 60.96,59.05 59.69,57.78 U$2.P$39
CON4-2
  Top 0.813: CON-SAT4.9 58.42,59.05 57.15,57.78 U$2.P$38
CON4-3
  Top 0.813: U$2.P$37 54.61,62.23 57.15,64.77 CON-SAT4.10
CON4-4
  Top 0.813: U$2.P$36 52.07,62.23 56.52,66.67 60.33,66.67 60.96,66.04 CON-SAT4.8
CON4-5
  Top 0.813: U$2.P$45 74.93,62.23 70.48,66.67 66.67,66.67 66.04,66.04 CON-SAT4.4
CON4-6
  Top 0.813: U$2.P$44 72.39,62.23 69.85,64.77 CON-SAT4.2
CON4-7
  Top 0.813: CON-SAT4.1 68.58,59.69 69.85,58.42 U$2.P$43
CON4-8
  Top 0.813: CON-SAT4.3 66.04,59.05 67.31,57.78 U$2.P$42
CS1
  Top 0.813: U$1.10 53.59,32.77 53.59,42.29 52.7,43.18 SPI-DRIVER.4
CS2
  Top 0.813: U$1.9 54.99,33.91 54.99,44.58 53.85,45.72 SPI-DRIVER.5
D0
  Top 0.406: U1.11 35.56,41.91 36.83,40.64 36.83,39.37 37.47,38.73 RN2.5
  Top 0.813: CON-IHM.8 33.66,35.56 34.92,36.83 38.1,36.83 38.73,37.47 RN2.5
D1
  Top 0.406: U1.12 35.56,43.18 37.47,41.27 RN2.4
  Top 0.813: CON-IHM.10 41.27,38.1 41.27,40.64 40.64,41.27 RN2.4
D2
  Top 0.406: U1.13 36.2,44.45 36.83,43.81 RN2.3
  Top 0.813: CON-IHM.9 43.18,37.47 43.18,41.91 41.27,43.81 RN2.3
D3
  Top 0.406: U1.14 36.2,45.72 36.83,46.35 RN2.2
  Bottom 0.813: CON-IHM.7 33.66,29.21 34.29,28.57 37.47,28.57 41.27,32.38 41.27,44.45 39.37,46.35 RN2.2
D4
  Top 0.406: U1.3 26.04,45.72 25.4,46.35 RN1.2
  Bottom 0.813: CON-IHM.3 28.57,29.84 27.3,28.57 24.77,28.57 21.59,31.75 21.59,45.09 22.86,46.35 RN1.2
D5
  Top 0.406: U1.4 26.04,44.45 25.4,43.81 RN1.3
  Top 0.813: CON-IHM.1 19.68,36.83 19.68,40.64 22.86,43.81 RN1.3
D6
  Top 0.406: U1.5 26.67,43.18 24.77,41.27 RN1.4
  Top 0.813: CON-IHM.2 21.59,37.47 21.59,40.01 22.86,41.27 RN1.4
D7
  Top 0.406: U1.6 26.67,41.91 26.04,41.27 26.04,39.37 25.4,38.73 RN1.5
  Top 0.813: RN1.5 24.13,37.47 24.77,36.83 27.3,36.83 28.57,35.56 CON-IHM.4
DA
  Top 0.813: U$1.23/A9 75.56,15.88 75.56,10.79 74.93,10.16 ENCODEUR_DROIT.4
DATA_MUX
  Top 0.406: U1.9 32.38,39.37 31.62,40.13 31.62,50.28 32.73,51.38 38.18,51.38 39.37,52.58 U$2.P$31
DB
  Top 0.813: ENCODEUR_DROIT.3 72.39,7.62 71.75,8.26 71.75,15.88 U$1.22/A8
DIR_L
  Top 0.813: U$1.6 64.77,38.1 DRIVER-MOTEUR.2
DIR_R
  Top 0.813: DRIVER-MOTEUR.7 75.56,36.83 72.39,33.66 U$1.3
DX
  Top 0.406: 73.66,15.24 73.66,17.78
  Top 0.813: ENCODEUR_DROIT.5 73.66,15.24 | 73.66,17.78 73.66,18.41 73.03,19.05 U$1.A10
GA
  Top 0.813: ENCODEUR_GAUCHE.4 69.22,10.16 69.85,10.79 U$1.21/A7
GB
  Top 0.813: ENCODEUR_GAUCHE.3 65.41,7.62 64.77,8.26 64.77,13.97 U$1.20/A6
GND
  pour Top: -0.64,86.36 86.36,86.36 86.36,-0.64 -0.64,-0.64
  pour Bottom: -0.64,87 87,87 87,-1.27 -1.27,-1.27 -1.27,87
GX
  Top 0.406: 68.58,15.24 68.58,17.78
  Top 0.813: ENCODEUR_GAUCHE.5 67.94,12.7 68.58,13.34 68.58,15.24 | 68.58,17.78 68.58,18.41 69.22,19.05 U$1.A11
INT_BALISE
  Top 0.406: 58.42,30.48 58.42,33.02
  Top 0.813: U$1.24 62.23,26.67 58.42,30.48 | 58.42,33.02 57.78,33.66 57.15,33.66 56.52,34.29 56.52,34.92 56.52,37.47 57.15,38.1 COM-BALISE.2
IO-ADVERSAIRE1
  Top 0.813: U$1.33 62.23,19.68 60.96,18.41 47.62,18.41 39.37,10.16 33.02,10.16 31.75,8.89 ADVERSAIRE_1.3
IO-ADVERSAIRE2
  Top 0.813: U$1.32 59.69,20.95 58.42,19.68 46.99,19.68 38.73,11.43 27.3,11.43 24.77,8.89 ADVERSAIRE_2.3
IO-BORDURE1
  Top 0.813: U$1.17/A3 BORDURE_1.3
IO-BORDURE2
  Top 0.813: U$1.16/A2 57.15,13.97 52.7,9.53 BORDURE_2.3
IO-BORDURE3
  Top 0.813: U$1.15/A1 54.61,13.97 48.26,7.62 BORDURE_3.3
IO-BORDURE4
  Top 0.813: U$1.14/A0 52.07,13.97 48.26,10.16 41.27,10.16 BORDURE_4.3
IO-TIRETTE
  Top 0.813: U$2.P$33 44.45,51.44 TIRETTE.2
LATCH_MUX
  Top 0.406: U$2.P$29 34.29,53.98 33.38,53.06 32.14,53.06 29.84,50.77 29.84,48.63 29.47,48.26 U1.1
LCD_BLA
  Top 0.813: R1.1 4.29,55.09 CON-LCD.2
LCD_V0
  Top 0.813: P1.3 13.97,62.87 CON-LCD.7
M0
  Top 0.406: 63.5,33.02 63.5,30.48
  Top 0.813: U$1.A12 67.31,26.67 66.04,27.94 64.77,27.94 63.5,29.21 63.5,30.48 | DRIVER-MOTEUR.4 70.48,42.55 69.85,43.18 66.67,43.18 62.87,39.37 62.87,34.29 62.87,33.66 63.5,33.02
M1
  Top 0.813: U$1.0 80.01,34.42 81.03,35.43 81.03,41.27 79.38,42.93 75.95,42.93 75.56,42.55 DRIVER-MOTEUR.8
M2
  Top 0.813: U$1.1 77.47,33.66 79.76,35.94 79.76,40.77 79.25,41.27 DRIVER-MOTEUR.10
MISO
  Bottom 0.813: U$2.P$14 49.53,67.94 47.62,66.04 17.78,66.04 13.34,61.59 10.16,61.59 8.89,62.87 8.89,66.67 8.26,67.31 3.17,67.31 2.54,66.67 2.54,60.96 3.17,60.33 CON-LCD.6
MISO_DRIVER
  Top 0.813: U$1.12 49.53,33.02 50.16,33.66 SPI-DRIVER.1
MOSI
  Bottom 0.813: CON-LCD.5 13.97,60.33 18.41,64.77 49.53,64.77 52.07,67.31 U$2.P$13
MOSI_DRIVER
  Top 0.813: SPI-DRIVER.3 51.44,40.64 52.07,40.01 U$1.11
N$1
  Top 1.27: R5.1 LED_REGUL.A
N$3
  Top 1.27: R4.1 LED_BATT.A
N$4
  Bottom 2.54: U$5.P$1 9.48,40.6 RU1.P$1
RX_BALISE
  Top 0.813: U$1.8 59.69,32.38 60.33,33.02 60.33,40.01 59.69,40.64 COM-BALISE.3
SCK
  Bottom 0.813: U$2.P$35 49.53,56.52 48.26,57.78 14.61,57.78 10.16,53.34 3.17,53.34 1.91,54.61 1.91,56.52 3.17,57.78 CON-LCD.4
SCK_DRIVER
  Bottom 0.813: U$1.13 49.53,27.94 47.62,29.84 47.62,36.83 48.9,38.1 SPI-DRIVER.2
SCL
  Top 0.813: U$2.P$41 COM-I2C.3 64.77,48.9 66.04,47.62 71.12,47.62 73.03,49.53 R2.1
  Bottom 0.813: U$1.19/A5 64.77,13.97 63.5,12.7 46.35,12.7 45.09,13.97 45.09,45.72 48.9,49.53 59.69,49.53 60.33,50.16 60.33,50.8 60.96,51.44 64.14,51.44 64.77,50.8 COM-I2C.3
SDA
  Top 0.813: U$2.P$40 COM-I2C.4 62.23,47.62 63.63,46.23 R3.1
  Bottom 0.813: U$1.18/A4 62.23,14.61 61.59,13.97 46.99,13.97 46.35,14.61 46.35,45.09 49.53,48.26 61.59,48.26 62.23,48.9 COM-I2C.4
SLEEP
  Top 0.813: DRIVER-MOTEUR.3 70.48,34.29 69.85,33.66 U$1.4
STEP_L
  Top 0.813: DRIVER-MOTEUR.1 67.94,34.29 67.31,33.66 U$1.5
STEP_R
  Top 0.813: DRIVER-MOTEUR.9 78.11,36.83 74.93,33.66 U$1.2
TX_BALISE
  Top 0.813: U$1.7 61.59,32.38 61.59,42.55 60.96,43.18 COM-BALISE.4
VIN/BATT
  Top 1.27: RU1.P$2 9.53,28.48 PS1.1 | C1.+ 13.09,32.05 PS1.1 | R4.2 10.95,18.26 9.53,19.68 6.35,19.68 5.08,20.95 5.08,26.04 5.97,26.92 PS1.1
  Bottom 1.27: PS1.1 5.08,26.92 D1.KATHODE
XBEE-RX
  Top 0.813: COM-XBEE.3 20.32,50.8 24.13,54.61 U$2.P$25
XBEE-TX
  Top 0.813: U$2.P$26 26.67,56.52 26.04,57.15 23.5,57.15 19.68,53.34 COM-XBEE.4

### Text on the board
tPlace: MAIN-BOARD V2 / 2020 / Barbatronic / cc-by